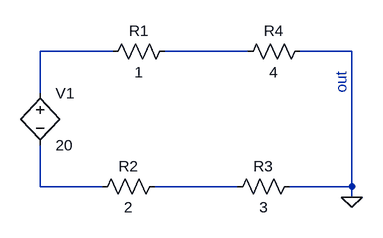
[diagram p0: schematic Ltspice vezba.asc]
Ltspice vezba.asc, the LTspice schematic file:
Version 4
SHEET 1 880 680
WIRE 112 96 0 96
WIRE 320 96 192 96
WIRE 480 96 400 96
WIRE 0 160 0 96
WIRE 0 304 0 240
WIRE 96 304 0 304
WIRE 304 304 176 304
WIRE 480 304 480 96
WIRE 480 304 384 304
WIRE 480 320 480 304
FLAG 480 320 0
SYMBOL res 192 288 R90
WINDOW 0 0 56 VBottom 2
WINDOW 3 32 56 VTop 2
SYMATTR InstName R2
SYMATTR Value 2
SYMBOL res 208 80 R90
WINDOW 0 0 56 VBottom 2
WINDOW 3 32 56 VTop 2
SYMATTR InstName R1
SYMATTR Value 1
SYMBOL res 400 288 R90
WINDOW 0 0 56 VBottom 2
WINDOW 3 32 56 VTop 2
SYMATTR InstName R3
SYMATTR Value 3
SYMBOL res 416 80 R90
WINDOW 0 0 56 VBottom 2
WINDOW 3 32 56 VTop 2
SYMATTR InstName R4
SYMATTR Value 4
SYMBOL bv 0 144 R0
WINDOW 123 0 0 Left 2
WINDOW 39 0 0 Left 2
SYMATTR InstName V1
SYMATTR Value 20
SYMATTR Prefix V1
TEXT 464 160 VLeft 2 ;out

The netlist it stands for:
* Ltspice vezba.asc
R2 N004 N003 2
R1 N002 N001 1
R3 0 N004 3
R4 0 N002 4
V1 N001 N003 20
* out
.backanno
.end